# Altium schematic sheet QSFP_Cages_Connectors.SchDoc
size B; SheetNumber: 3; SheetTotal: 11
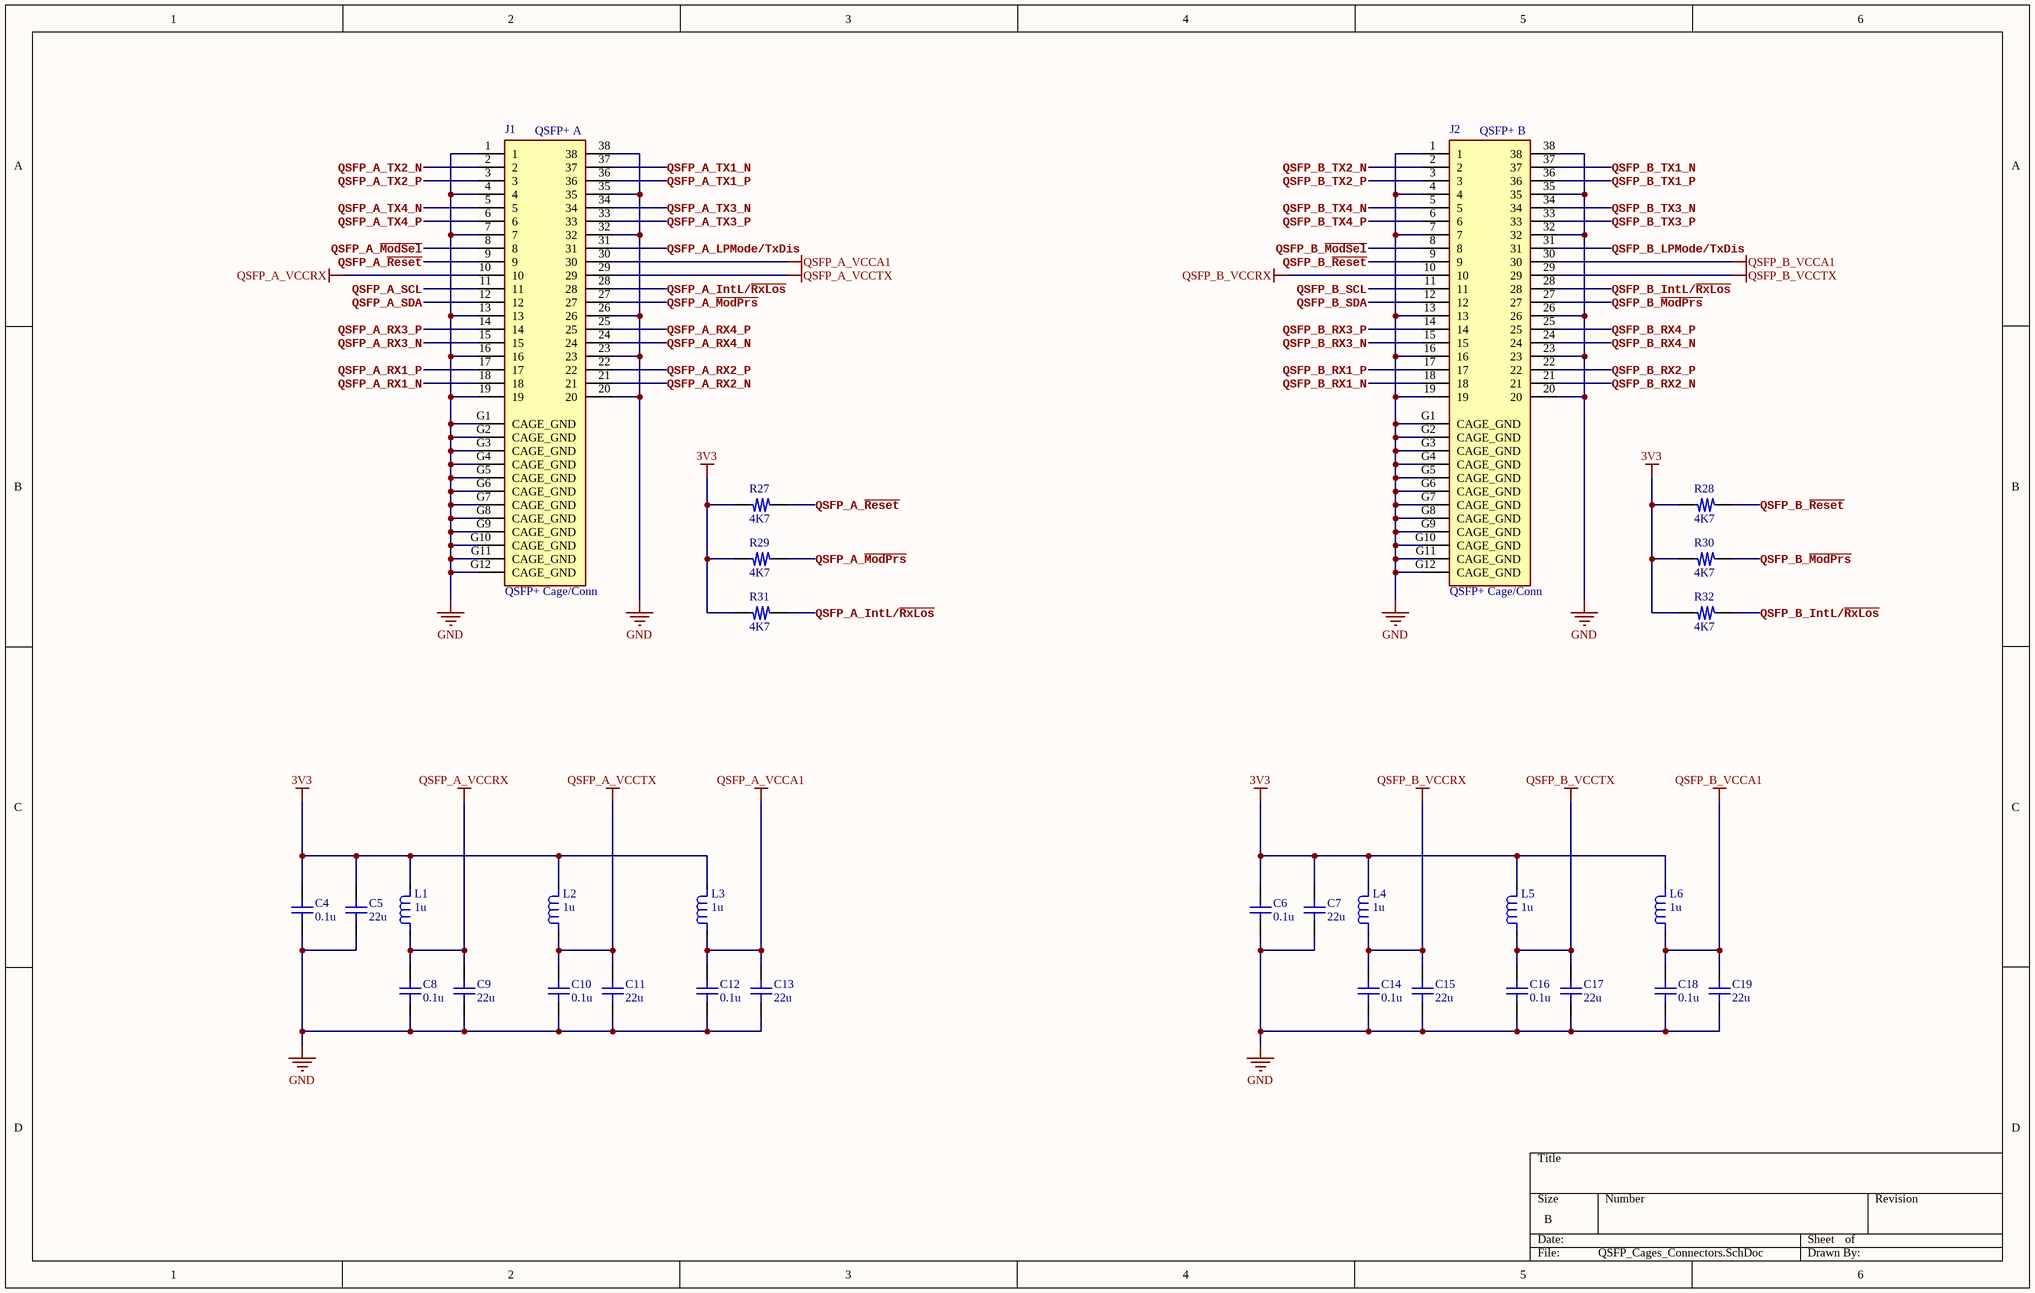
[diagram p0: QSFP_Cages_Connectors.SchDoc]

## Parts
C4  0.1u  [C_0402_Generic]
C5  22u  [C_0603_Generic]
C6  0.1u  [C_0402_Generic]
C7  22u  [C_0603_Generic]
C8  0.1u  [C_0402_Generic]
C9  22u  [C_0603_Generic]
C10  0.1u  [C_0402_Generic]
C11  22u  [C_0603_Generic]
C12  0.1u  [C_0402_Generic]
C13  22u  [C_0603_Generic]
C14  0.1u  [C_0402_Generic]
C15  22u  [C_0603_Generic]
C16  0.1u  [C_0402_Generic]
C17  22u  [C_0603_Generic]
C18  0.1u  [C_0402_Generic]
C19  22u  [C_0603_Generic]
J1  QSFP+ Cage/Conn  [AMPHENOL_U95T151100A]
J2  QSFP+ Cage/Conn  [AMPHENOL_U95T151100A]
L1  1u  [Murata_Ind_1008]
L2  1u  [Murata_Ind_1008]
L3  1u  [Murata_Ind_1008]
L4  1u  [Murata_Ind_1008]
L5  1u  [Murata_Ind_1008]
L6  1u  [Murata_Ind_1008]
R27  4K7  [R_0402_Generic]
R28  4K7  [R_0402_Generic]
R29  4K7  [R_0402_Generic]
R30  4K7  [R_0402_Generic]
R31  4K7  [R_0402_Generic]
R32  4K7  [R_0402_Generic]

## Nets
3V3: C4.2 C5.2 C6.2 C7.2 L1.1 L2.1 L3.1 L4.1 L5.1 L6.1 R27.2 R28.2 R29.2 R30.2 R31.2 R32.2
GND: C4.1 C5.1 C6.1 C7.1 C8.1 C9.1 C10.1 C11.1 C12.1 C13.1 C14.1 C15.1 C16.1 C17.1 C18.1 C19.1 J1.1 J1.4 J1.7 J1.13 J1.16 J1.19 J1.20 J1.23 J1.26 J1.32 J1.35 J1.38 J1.G1(CAGE_GND) J1.G2(CAGE_GND) J1.G3(CAGE_GND) J1.G4(CAGE_GND) J1.G5(CAGE_GND) J1.G6(CAGE_GND) J1.G7(CAGE_GND) J1.G8(CAGE_GND) J1.G9(CAGE_GND) J1.G10(CAGE_GND) J1.G11(CAGE_GND) J1.G12(CAGE_GND) J2.1 J2.4 J2.7 J2.13 J2.16 J2.19 J2.20 J2.23 J2.26 J2.32 J2.35 J2.38 J2.G1(CAGE_GND) J2.G2(CAGE_GND) J2.G3(CAGE_GND) J2.G4(CAGE_GND) J2.G5(CAGE_GND) J2.G6(CAGE_GND) J2.G7(CAGE_GND) J2.G8(CAGE_GND) J2.G9(CAGE_GND) J2.G10(CAGE_GND) J2.G11(CAGE_GND) J2.G12(CAGE_GND)
QSFP_A_VCCA1: C12.2 C13.2 J1.30 L3.2
QSFP_A_VCCRX: C8.2 C9.2 J1.10 L1.2
QSFP_A_VCCTX: C10.2 C11.2 J1.29 L2.2
QSFP_B_VCCA1: C18.2 C19.2 J2.30 L6.2
QSFP_B_VCCRX: C14.2 C15.2 J2.10 L4.2
QSFP_B_VCCTX: C16.2 C17.2 J2.29 L5.2
QSFP_A_IntL/~{RxLos}: J1.28 R31.1
QSFP_A_LPMode/TxDis: J1.31
QSFP_A_~{ModPrs}: J1.27 R29.1
QSFP_A_~{ModSel}: J1.8
QSFP_A_~{Reset}: J1.9 R27.1
QSFP_A_RX1_N: J1.18
QSFP_A_RX1_P: J1.17
QSFP_A_RX2_N: J1.21
QSFP_A_RX2_P: J1.22
QSFP_A_RX3_N: J1.15
QSFP_A_RX3_P: J1.14
QSFP_A_RX4_N: J1.24
QSFP_A_RX4_P: J1.25
QSFP_A_SCL: J1.11
QSFP_A_SDA: J1.12
QSFP_A_TX1_N: J1.37
QSFP_A_TX1_P: J1.36
QSFP_A_TX2_N: J1.2
QSFP_A_TX2_P: J1.3
QSFP_A_TX3_N: J1.34
QSFP_A_TX3_P: J1.33
QSFP_A_TX4_N: J1.5
QSFP_A_TX4_P: J1.6
QSFP_B_IntL/~{RxLos}: J2.28 R32.1
QSFP_B_LPMode/TxDis: J2.31
QSFP_B_~{ModPrs}: J2.27 R30.1
QSFP_B_~{ModSel}: J2.8
QSFP_B_~{Reset}: J2.9 R28.1
QSFP_B_RX1_N: J2.18
QSFP_B_RX1_P: J2.17
QSFP_B_RX2_N: J2.21
QSFP_B_RX2_P: J2.22
QSFP_B_RX3_N: J2.15
QSFP_B_RX3_P: J2.14
QSFP_B_RX4_N: J2.24
QSFP_B_RX4_P: J2.25
QSFP_B_SCL: J2.11
QSFP_B_SDA: J2.12
QSFP_B_TX1_N: J2.37
QSFP_B_TX1_P: J2.36
QSFP_B_TX2_N: J2.2
QSFP_B_TX2_P: J2.3
QSFP_B_TX3_N: J2.34
QSFP_B_TX3_P: J2.33
QSFP_B_TX4_N: J2.5
QSFP_B_TX4_P: J2.6

## Notes on the sheet
- (near J1) QSFP+ A
- (near J2) QSFP+ B

## Library data of the parts
C4 C6 C8 C10 C12 C14 C16 C18 = GRM155R71C104KA88D: 0.1µF 16V X7R SMD ceramic capacitor in 0402 size; Manufacturer: Murata Electronics; Manufacturer Part Number: GRM155R71C104KA88D
C5 C7 C9 C11 C13 C15 C17 C19 = GRM188R60J226MEA0D: 22µF 6.3V X5R SMD ceramic capacitor in 0603 size; Manufacturer: Murata Electronics; Manufacturer Part Number: GRM188R60J226MEA0D
J1 J2 = U95T151100A: NOTE: Notes Also uses one FS1-Z38-20Z6-60. 38 Position QSFP+ Receptacle; MF: Amphenol; Package: None; Availability: In Stock; SnapEDA_Link: https://www.snapeda.com/parts/U95T151100A/Amphenol/view-part/?ref=snap; MP: U95T151100A; Price: None; Check_prices: https://www.snapeda.com/parts/U95T151100A/Amphenol/view-part/?ref=eda; Purchase-URL: https://pricing.snapeda.com/search/part/U95T151100A/?ref=eda; Value: *
L1-L6 = DFE252012F-1R0M=P2: 1µH Shielded 3.3A 40mOhm 1008 Inductor; Manufacturer: Murata Electronics; Manufacturer Part Number: DFE252012F-1R0M=P2
R27-R32 = ERJ-2RKF4701X: 4.7KOhm 1% 1/10W SMD resistor in 0402 size; Manufacturer: Panasonic; Manufacturer Part Number: ERJ-2RKF4701X